# Altium project HLib-Sensor-Accel_Gyro-Pressure.PrjPcb
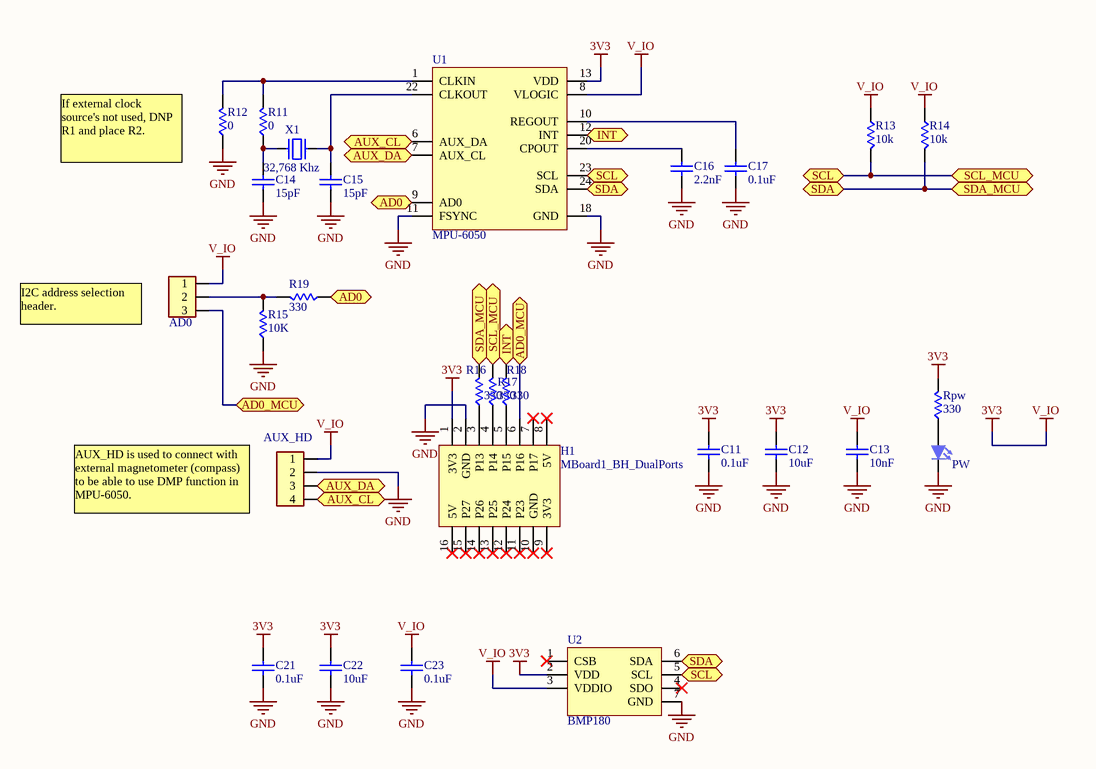
[diagram p0: HLib-Sensor-Accel_Gyro-Pressure.SchDoc]
1 sheet, 27 parts. Net scope: flat (ports and power ports of the same name join across sheets).
Board file: HLib-Sensor-Accel_Gyro-Pressure.PcbDoc

## Sheet HLib-Sensor-Accel_Gyro-Pressure.SchDoc
size A4

### Parts
AD0  HEADER 3  [HD_MALE_3]  (value not drawn)
AUX_HD  HEADER 4  [HD_MALE_4]  (value not drawn)
C11  CAP  [SM_0805_C_CERAMIC]  (value not drawn)
C12  CAP  [SM_0805_C_CERAMIC]  (value not drawn)
C13  CAP  [SM_0805_C_CERAMIC]  (value not drawn)
C14  CAP  [SM_0805_C_CERAMIC]  (value not drawn)
C15  CAP  [SM_0805_C_CERAMIC]  (value not drawn)
C16  CAP  [SM_0805_C_CERAMIC]  (value not drawn)
C17  CAP  [SM_0805_C_CERAMIC]  (value not drawn)
C21  CAP  [SM_0805_C_CERAMIC]  (value not drawn)
C22  CAP  [SM_0805_C_CERAMIC]  (value not drawn)
C23  CAP  [SM_0805_C_CERAMIC]  (value not drawn)
H1  MBoard1_BH_DualPorts  [MBoard1_BH_DualPorts]
PW  LED  [SM_0805_LED]  (value not drawn)
R11  value 0  [SM_0805_R]  (hidden comment: R)
R12  value 0  [SM_0805_R]  (hidden comment: R)
R13  value 10k  [SM_0805_R]  (hidden comment: R)
R14  value 10k  [SM_0805_R]  (hidden comment: R)
R15  value 10K  [SM_0805_R]  (hidden comment: R)
R16  value 330  [SM_0805_R]  (hidden comment: R)
R17  value 330  [SM_0805_R]  (hidden comment: R)
R18  value 330  [SM_0805_R]  (hidden comment: R)
R19  value 330  [SM_0805_R]  (hidden comment: R)
Rpw  value 330  [SM_0805_R]  (hidden comment: R)
U1  MPU-6050  [QFN-24]
U2  BMP180  [LGA-7]
X1  32,768 Khz  [XT32k]

### Ports
AD0 (bidir), AD0_MCU (bidir), AUX_CL (bidir), AUX_DA (bidir), INT (bidir), SCL (bidir), SCL_MCU (bidir), SDA (bidir), SDA_MCU (bidir)

### Nets
3V3: AD0.1 AUX_HD.1 C11.2 C12.2 C13.2 C21.2 C22.2 C23.2 H1.1(3V3) R13.1 R14.1 Rpw.2 U1.8(VLOGIC) U1.13(VDD) U2.2(VDD) U2.3(VDDIO)  [also labelled V_IO]
GND: AUX_HD.2 C11.1 C12.1 C13.1 C14.1 C15.1 C16.1 C17.1 C21.1 C22.1 C23.1 H1.2(GND) PW.2(K) R12.1 R15.1 U1.11(FSYNC) U1.18(GND) U2.7(GND)
NetAD0_2: AD0.2 R15.2 R19.2
NetAD0_3: AD0.3 H1.6(P16) ; port AD0_MCU
NetAUX_HD_3: AUX_HD.3 U1.7(AUX_CL) ; port AUX_DA
NetAUX_HD_4: AUX_HD.4 U1.6(AUX_DA) ; port AUX_CL
NetC14_2: C14.2 R11.1 X1.2
NetC15_2: C15.2 U1.22(CLKOUT) X1.1
NetC16_2: C16.2 U1.20(CPOUT)
NetC17_2: C17.2 U1.10(REGOUT)
NetH1_3: H1.3(P13) R16.1
NetH1_4: H1.4(P14) R17.1
NetH1_5: H1.5(P15) R18.1
NetPW_1: PW.1(A) Rpw.1
NetR11_2: R11.2 R12.2 U1.1(CLKIN)
NetR13_2: R13.2 R17.2 U1.23(SCL) U2.5(SCL) ; port SCL, port SCL_MCU
NetR14_2: R14.2 R16.2 U1.24(SDA) U2.6(SDA) ; port SDA, port SDA_MCU
NetR18_2: R18.2 U1.12(INT) ; port INT
NetR19_1: R19.1 U1.9(AD0) ; port AD0

Not connected (* = marked no-connect by the designer): H1 7(P17)* 8(5V)* 9(3V3)* 10(GND)* 11(P23)* 12(P24)* 13(P25)* 14(P26)* 15(P27)* 16(5V)*; U2 1(CSB)* 4(SDO)*

### Notes on the sheet
- (near R12) If external clock source's not used, DNP R1 and place R2.
- I2C address selection header.
- AUX_HD is used to connect with external magnetometer (compass) to be able to use DMP function in MPU-6050.
- (in symbol CAP) 15pF; 10nF; 0.1uF; 2.2nF; 10uF

### Library data of the parts
AD0 = HD_3: Header single row 3 pins
AUX_HD = HD_4: Header single row 4 pins
C11-C17 C21-C23 = CAP: Capacitor
R11-R19 Rpw = R: Resistor; Published: 8-Jun-2000; LatestRevisionDate: 29-May-2009; LatestRevisionNote: IPC-7351 Footprint Added.; PackageReference: J1-0603; Publisher: Altium Limited; PackageDescription: Chip Resistor
U1 = MPU_6050: Motion processing unit
U2 = BMP180: Bosch's Digital pressure sensor
X1 = XT32k: Crystal 32,768kHz for timer real; Value: 32,768khz
PW = LED: Published: 8-Jun-2000; LatestRevisionDate: 08-Jul-2005; LatestRevisionNote: Mech Layer 1 removed.; PackageReference: LED-1; Publisher: Altium Limited; PackageDescription: LED; 2 Leads